# Altium schematic sheet Sheet1.SchDoc
size B; PageSetup: Record=PageOptions|CenterHorizontal=True|CenterVertical=True|PrintScale=0.72|XCorrection=1.00|YCorrection=1.00|PrintKind=0|BorderSize=5000000|LeftOffset=0|BottomOffset=0|Orientation=2|PaperLength=1000|PaperWidth=1000|Scale=100|PaperSource=7|PrintQuality=-4|MediaType=1|DitherType=10|PaperKind=Letter|PrintScaleMode=1
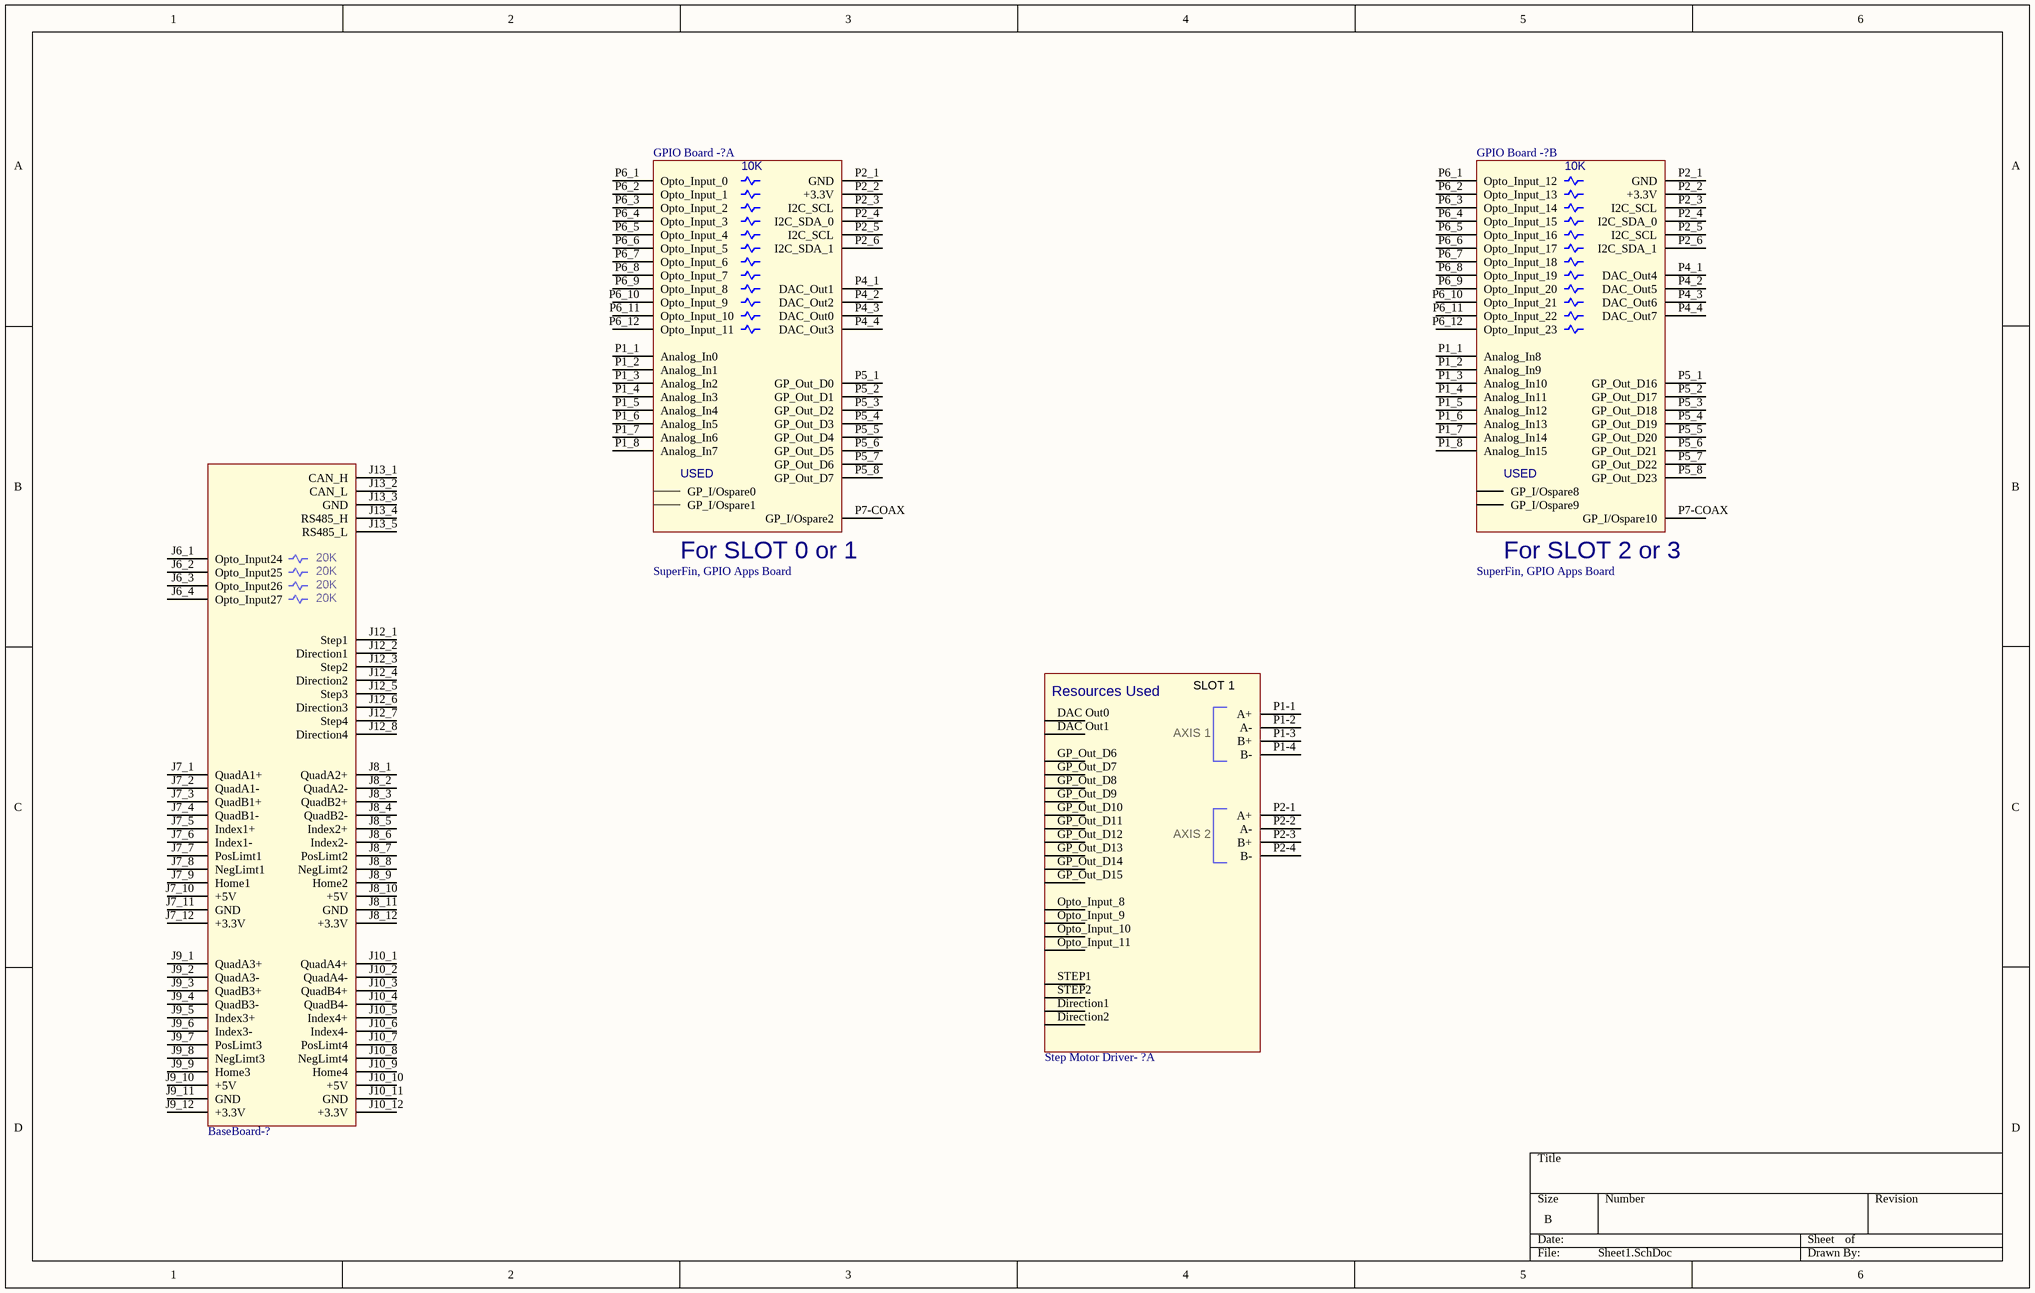
[diagram p0: Sheet1.SchDoc]

## Parts
(Parts that share a designator on the sheet are numbered #1, #2 ... from top to bottom, then left to right.)
BaseBoard-?  SuperFin BaseBoard  (value not drawn)
GPIO_Board_-?#1  SuperFin, GPIO Apps Board  (part A of 2)
GPIO_Board_-?#2  SuperFin, GPIO Apps Board  (part B of 2)
Step_Motor_Driver-_?  SuperFin, 2 Axis Step Motor Driver  (value not drawn)  (part A of 2)

## Nets

Not connected (* = marked no-connect by the designer): BaseBoard-? J6_1(Opto_Input24) J6_2(Opto_Input25) J6_3(Opto_Input26) J6_4(Opto_Input27) J7_1(QuadA1+) J7_2(QuadA1-) J7_3(QuadB1+) J7_4(QuadB1-) J7_5(Index1+) J7_6(Index1-) J7_7(PosLimt1) J7_8(NegLimt1) J7_9(Home1) J7_10(+5V) J7_11(GND) J7_12(+3.3V) J8_1(QuadA2+) J8_2(QuadA2-) J8_3(QuadB2+) J8_4(QuadB2-) J8_5(Index2+) J8_6(Index2-) J8_7(PosLimt2) J8_8(NegLimt2) J8_9(Home2) J8_10(+5V) J8_11(GND) J8_12(+3.3V) J9_1(QuadA3+) J9_2(QuadA3-) J9_3(QuadB3+) J9_4(QuadB3-) J9_5(Index3+) J9_6(Index3-) J9_7(PosLimt3) J9_8(NegLimt3) J9_9(Home3) J9_10(+5V) J9_11(GND) J9_12(+3.3V) J10_1(QuadA4+) J10_2(QuadA4-) J10_3(QuadB4+) J10_4(QuadB4-) J10_5(Index4+) J10_6(Index4-) J10_7(PosLimt4) J10_8(NegLimt4) J10_9(Home4) J10_10(+5V) J10_11(GND) J10_12(+3.3V) J12_1(Step1) J12_2(Direction1) J12_3(Step2) J12_4(Direction2) J12_5(Step3) J12_6(Direction3) J12_7(Step4) J12_8(Direction4) J13_1(CAN_H) J13_2(CAN_L) J13_3(GND) J13_4(RS485_H) J13_5(RS485_L); GPIO_Board_-?#1 0(GP_I/Ospare1) P1_1(Analog_In0) P1_2(Analog_In1) P1_3(Analog_In2) P1_4(Analog_In3) P1_5(Analog_In4) P1_6(Analog_In5) P1_7(Analog_In6) P1_8(Analog_In7) P2_1(GND) P2_2(+3.3V) P2_3(I2C_SCL) P2_4(I2C_SDA_0) P2_5(I2C_SCL) P2_6(I2C_SDA_1) P4_1(DAC_Out1) P4_2(DAC_Out2) P4_3(DAC_Out0) P4_4(DAC_Out3) P5_1(GP_Out_D0) P5_2(GP_Out_D1) P5_3(GP_Out_D2) P5_4(GP_Out_D3) P5_5(GP_Out_D4) P5_6(GP_Out_D5) P5_7(GP_Out_D6) P5_8(GP_Out_D7) P6_1(Opto_Input_0) P6_2(Opto_Input_1) P6_3(Opto_Input_2) P6_4(Opto_Input_3) P6_5(Opto_Input_4) P6_6(Opto_Input_5) P6_7(Opto_Input_6) P6_8(Opto_Input_7) P6_9(Opto_Input_8) P6_10(Opto_Input_9) P6_11(Opto_Input_10) P6_12(Opto_Input_11) P7-COAX(GP_I/Ospare2); GPIO_Board_-?#2 0(GP_I/Ospare9) P1_1(Analog_In8) P1_2(Analog_In9) P1_3(Analog_In10) P1_4(Analog_In11) P1_5(Analog_In12) P1_6(Analog_In13) P1_7(Analog_In14) P1_8(Analog_In15) P2_1(GND) P2_2(+3.3V) P2_3(I2C_SCL) P2_4(I2C_SDA_0) P2_5(I2C_SCL) P2_6(I2C_SDA_1) P4_1(DAC_Out4) P4_2(DAC_Out5) P4_3(DAC_Out6) P4_4(DAC_Out7) P5_1(GP_Out_D16) P5_2(GP_Out_D17) P5_3(GP_Out_D18) P5_4(GP_Out_D19) P5_5(GP_Out_D20) P5_6(GP_Out_D21) P5_7(GP_Out_D22) P5_8(GP_Out_D23) P6_1(Opto_Input_12) P6_2(Opto_Input_13) P6_3(Opto_Input_14) P6_4(Opto_Input_15) P6_5(Opto_Input_16) P6_6(Opto_Input_17) P6_7(Opto_Input_18) P6_8(Opto_Input_19) P6_9(Opto_Input_20) P6_10(Opto_Input_21) P6_11(Opto_Input_22) P6_12(Opto_Input_23) P7-COAX(GP_I/Ospare10); Step_Motor_Driver-_? DAC Out0 DAC Out1 Direction1 Direction2 GP_Out_D6 GP_Out_D7 GP_Out_D8 GP_Out_D9 GP_Out_D10 GP_Out_D11 GP_Out_D12 GP_Out_D13 GP_Out_D14 GP_Out_D15 Opto_Input_8 Opto_Input_9 Opto_Input_10 Opto_Input_11 P1-1(A+) P1-2(A-) P1-3(B+) P1-4(B-) P2-1(A+) P2-2(A-) P2-3(B+) P2-4(B-) STEP1 STEP2

## Notes on the sheet
- (in symbol SuperFin BaseBoard) 20K
- (in symbol SuperFin, 2 Axis Step Motor Driver, part A) SLOT 1; Resources Used; AXIS 1; AXIS 2
- (in symbol SuperFin, GPIO Apps Board, part A) 10K; USED; For SLOT 0 or 1
- (in symbol SuperFin, GPIO Apps Board, part B) 10K; USED; For SLOT 2 or 3